# EAGLE schematic oled_datalogger (EAGLE 7.3.0)
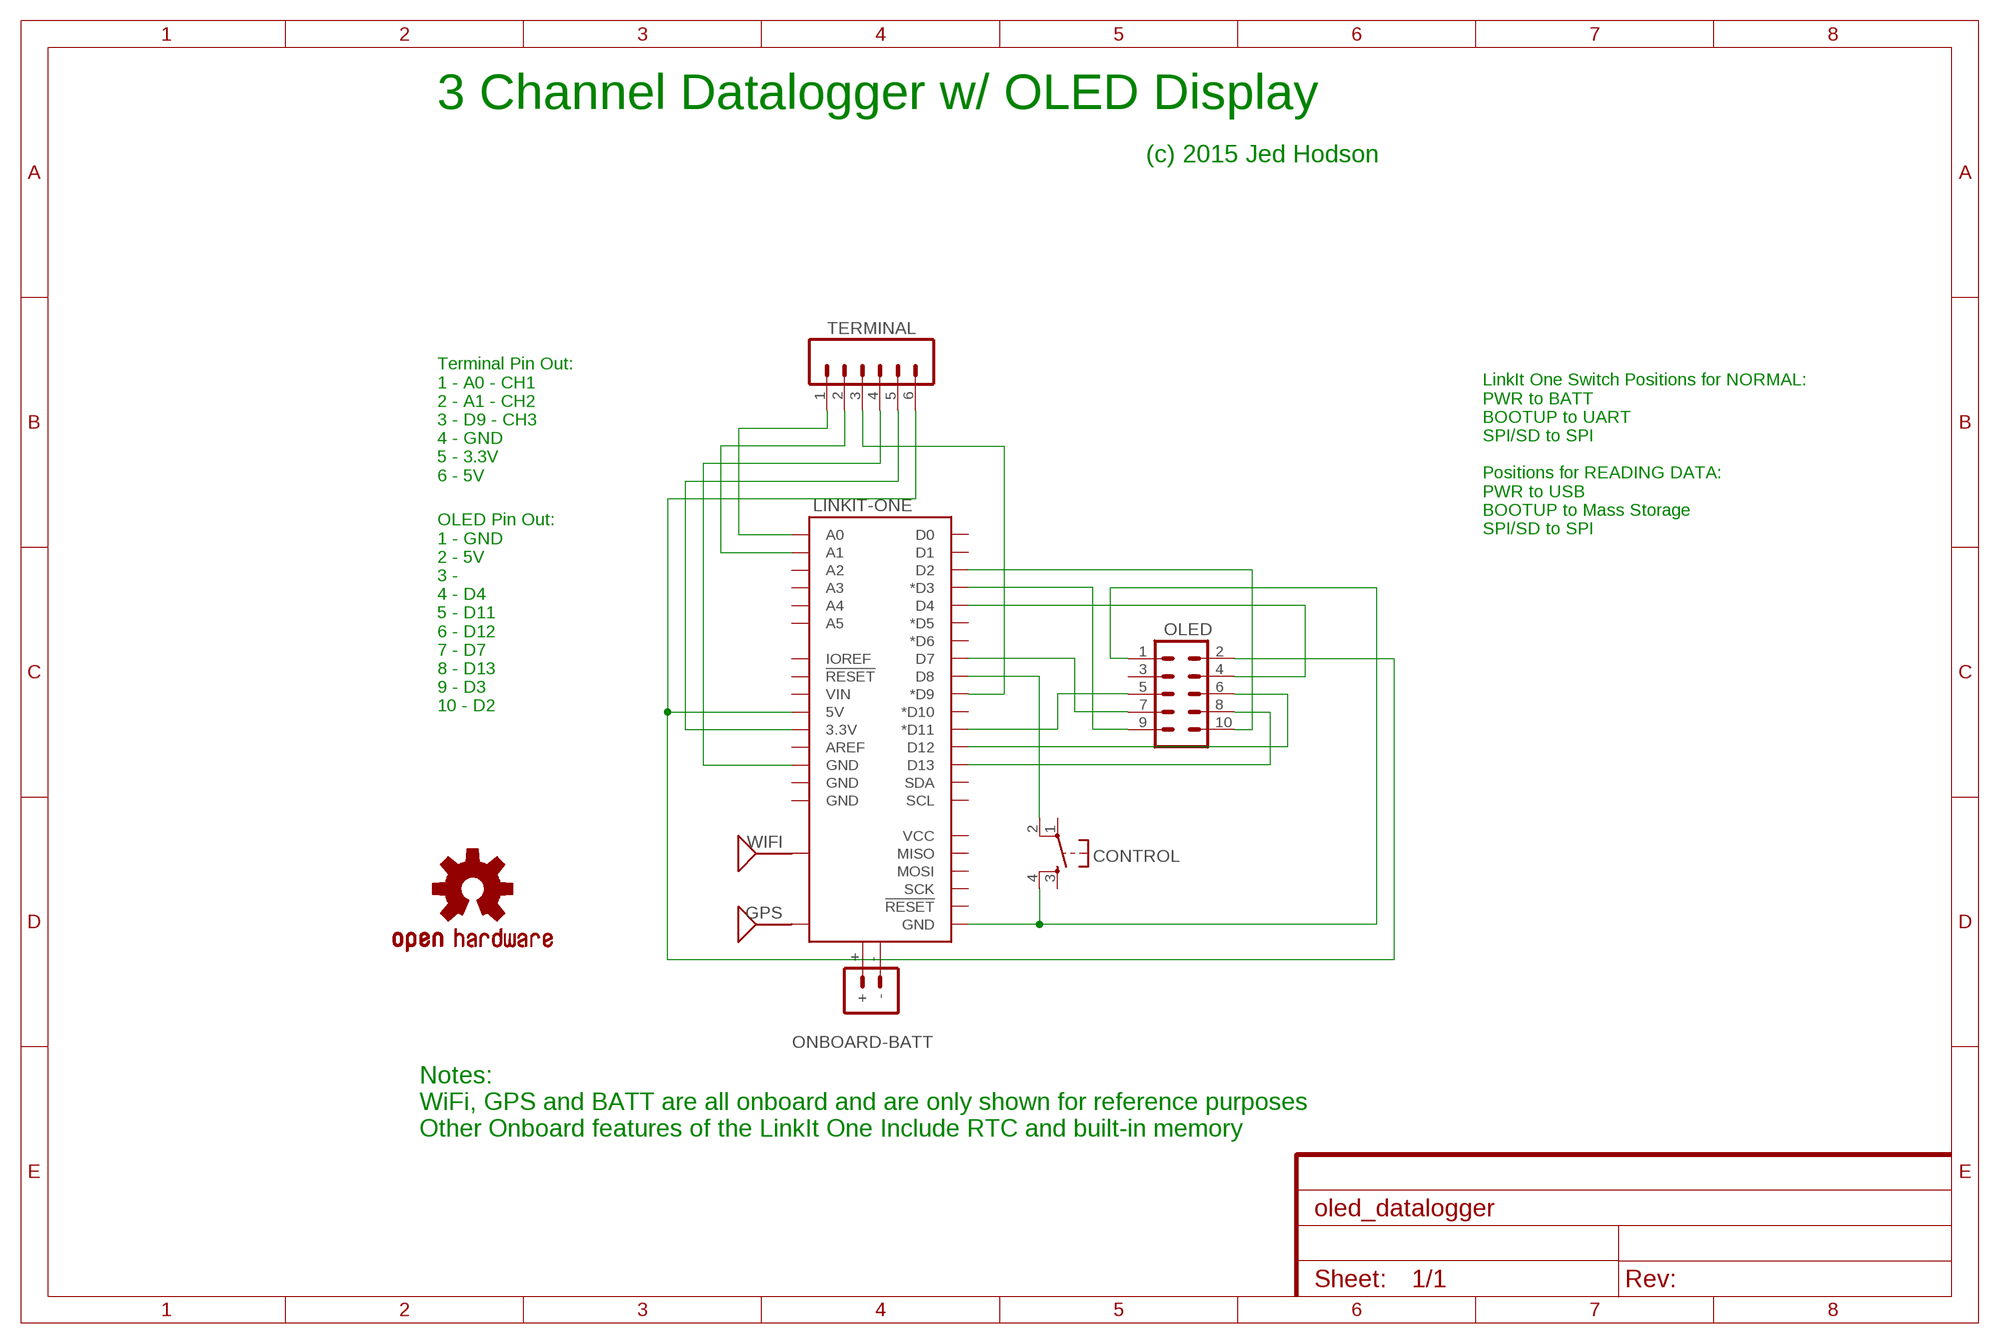
[diagram p0: schematic, sheet 1]

## Parts
CONTROL  TAC_SWITCHPTH  [TACTILE-PTH]
GPS  ANTENNA2SMD  [ANTENNA-CHIP2]
LINKIT-ONE  ARDUINO_R3NO_HOLES  [ARDUINO_R3_NO_HOLES]
LOGO1  OSHW-LOGOL  [OSHW-LOGO-L]
OLED  M05X2NO_SILK  [2X5_NOSILK]
ONBOARD-BATT  BATTERY_CONNDEANS  [DEANS]
TERMINAL  M06POGOPIN_HOLES_ONLY  [1X06_HOLES_ONLY]
WIFI  ANTENNA2SMD  [ANTENNA-CHIP2]

## Nets
N$1: LINKIT-ONE.A0 TERMINAL.1
N$2: LINKIT-ONE.A1 TERMINAL.2
N$3: LINKIT-ONE.GND@4(GND) TERMINAL.4
N$4: LINKIT-ONE.3.3V TERMINAL.5
N$5: LINKIT-ONE.5V OLED.2 TERMINAL.6
N$6: CONTROL.4 LINKIT-ONE.GND@1(GND) OLED.1
N$7: LINKIT-ONE.D12 OLED.6
N$8: LINKIT-ONE.D4 OLED.4
N$9: LINKIT-ONE.D11(*D11) OLED.5
N$10: LINKIT-ONE.D7 OLED.7
N$11: LINKIT-ONE.D3(*D3) OLED.9
N$12: LINKIT-ONE.D13 OLED.8
N$13: LINKIT-ONE.D2 OLED.10
N$14: LINKIT-ONE.D9(*D9) TERMINAL.3
N$15: CONTROL.2 LINKIT-ONE.D8
Unconnected: CONTROL.1 CONTROL.3 GPS.FEED(SIGNAL) LINKIT-ONE.A2 LINKIT-ONE.A3 LINKIT-ONE.A4 LINKIT-ONE.A5 LINKIT-ONE.AREF LINKIT-ONE.D0 LINKIT-ONE.D1 LINKIT-ONE.D5(*D5) LINKIT-ONE.D6(*D6) LINKIT-ONE.D10(*D10) LINKIT-ONE.GND@2(GND) LINKIT-ONE.GND@3(GND) LINKIT-ONE.IOREF LINKIT-ONE.MISO LINKIT-ONE.MOSI LINKIT-ONE.RESET@1(!RESET!) LINKIT-ONE.RESET@2(!RESET!) LINKIT-ONE.SCK LINKIT-ONE.SCL LINKIT-ONE.SDA LINKIT-ONE.VCC LINKIT-ONE.VIN OLED.3 ONBOARD-BATT.+ ONBOARD-BATT.- WIFI.FEED(SIGNAL)

## Notes on the sheet
- 3 Channel Datalogger w/ OLED Display
- (c) 2015 Jed Hodson
- Terminal Pin Out:
  1 - A0 - CH1
  2 - A1 - CH2
  3 - D9 - CH3
  4 - GND
  5 - 3.3V
  6 - 5V
- LinkIt One Switch Positions for NORMAL:
  PWR to BATT
  BOOTUP to UART
  SPI/SD to SPI
  
  Positions for READING DATA:
  PWR to USB
  BOOTUP to Mass Storage
  SPI/SD to SPI
- OLED Pin Out:
  1 - GND
  2 - 5V
  3 - 
  4 - D4
  5 - D11
  6 - D12
  7 - D7
  8 - D13
  9 - D3
  10 - D2
- Notes:
  WiFi, GPS and BATT are all onboard and are only shown for reference purposes
- Other Onboard features of the LinkIt One Include RTC and built-in memory

## Library data of the parts
CONTROL = SparkFun-Retired:TAC_SWITCH: Momentary Switch Button commonly used for reset or general input. Spark Fun Electronics SKU : COM-00097 SMT- SWCH-08247
GPS WIFI = SparkFun-RF:ANTENNA2: Chip antenna Single endded antenna. Common with smaller chip antennas. CHIP4 package is the GPS Chip Antenna SKU: GPS-08418. CHIP5 package is 2.4GHz chip antenna SKU: WRL-00144.
LINKIT-ONE = SparkFun-Boards:ARDUINO_R3: Arduino R3 Footprint (w/ SPI header)
LOGO1 = SparkFun-Aesthetics:OSHW-LOGO: Open Source Hardware Logo This logo indicates the piece of hardware it is found on incorporates a OSHW license and/or adheres to the definition of open source hardware found here: http://freedomdefined.org/OSHW
OLED = SparkFun-Connectors:M05X2: Header 5x2 Standard 10-pin dual row 0.1" header. Commonly used with AVR-ISP. Use with Spark Fun Electronics SKU: PRT-00778
ONBOARD-BATT = SparkFun-Connectors:BATTERY_CONN: Various footprints for battery connectors
TERMINAL = SparkFun-Connectors:M06: Header 6 Standard 6-pin 0.1" header. Use with straight break away headers (SKU : PRT-00116), right angle break away headers (PRT-00553), swiss pins (PRT-00743), machine pins (PRT-00117), and female headers (PRT-00115). Molex polarized connector foot print use with SKU : PRT-08094 with associated crimp pins and housings. NOTES ON THE VARIANTS LOCK and LOCK_LONGPADS... This footprint was designed to help hold the alignment of a through-hole component (i.e. 6-pin header) while soldering it into place. You may notice that each hole has been shifted either up or down by 0.005 of an inch from it's more standard position (which is a perfectly straight line). This slight alteration caused the pins (the squares in the middle) to touch the edges of the holes. Because they are alternating, it causes a "brace" to hold the component in place. 0.005 has proven to be the perfect amount of "off-center" position when using our standard breakaway headers. Although looks a little odd when you look at the bare footprint, once you have a header in there, the alteration is very hard to notice. Also,if you push a header all the way into place, it is covered up entirely on the bottom side. This idea of altering the position of holes to aid alignment will be further integrated into the Sparkfun Library for other footprints. It can help hold any component with 3 or more connection pins.; PROD_ID: CONN-08437